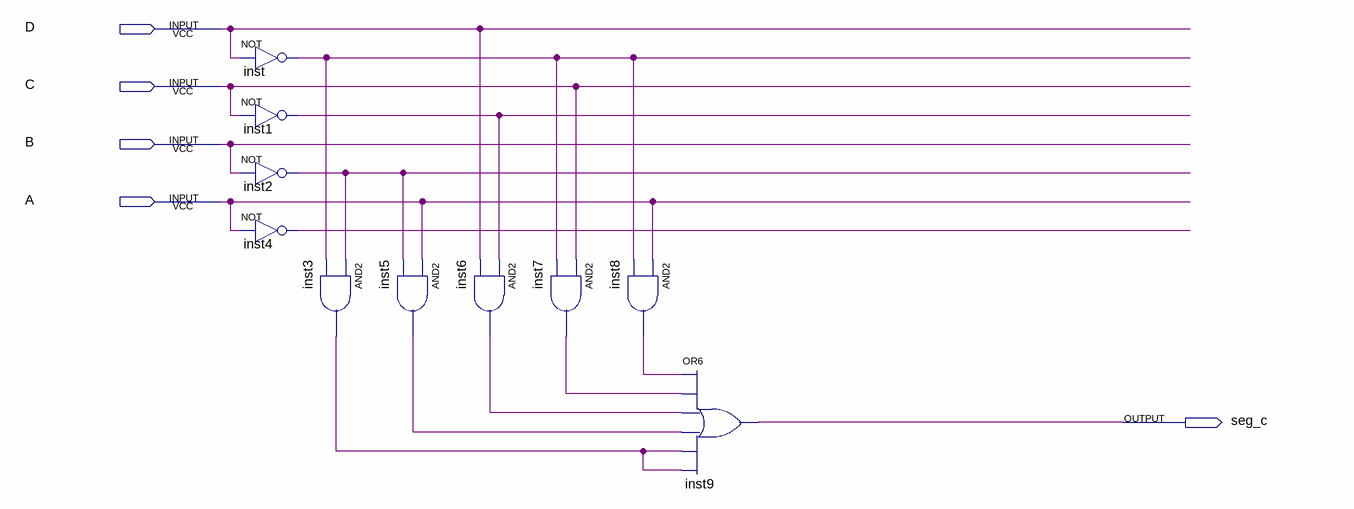
[diagram p0: schematic sheet]
// Quartus schematic seg_c.bdf as structural Verilog: 10 symbols, 5 pins
module seg_c (
  input  D,
  input  C,
  input  B,
  input  A,
  output seg_c
);

  wire inst1_out, inst2_out, inst3_out, inst4_out, inst5_out, inst6_out, inst7_out, inst8_out, inst_out;

  not inst (inst_out, D);
  not inst1 (inst1_out, C);
  not inst2 (inst2_out, B);
  not inst4 (inst4_out, A);
  and inst3 (inst3_out, inst2_out, inst_out);
  and inst5 (inst5_out, A, inst2_out);
  and inst6 (inst6_out, inst1_out, D);
  and inst7 (inst7_out, C, inst_out);
  and inst8 (inst8_out, A, inst_out);
  or inst9 (seg_c, inst8_out, inst7_out, inst6_out, inst5_out, inst3_out, inst3_out);
endmodule
